# Altium project nRF2789_Dual Wireless Mic RX .PrjPCB
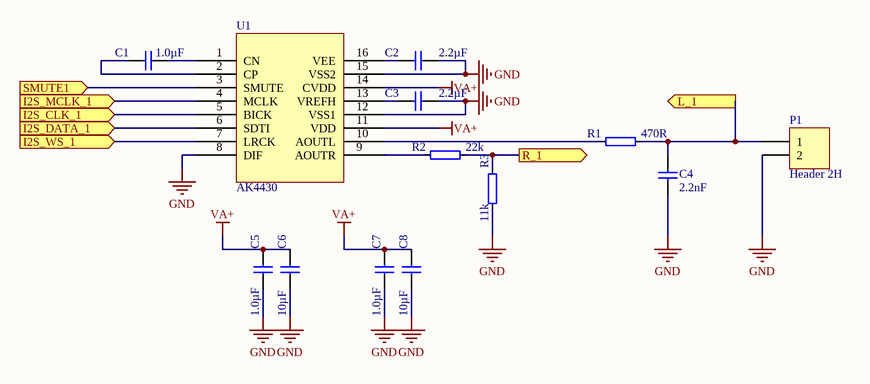
[diagram p0: AK4430_1.SchDoc]
7 sheets, 110 parts. Net scope: flat (ports and power ports of the same name join across sheets).
Board file: nRF2789_Dual Wireless Mic RX_V_1_0.PcbDoc
Sheets:
  AK4430_1.SchDoc
  Micro.SchDoc
  Power.SchDoc
  AK5374.SchDoc
  AK4430_2.SchDoc
  Nrf2460_1.SchDoc
  Nrf2460_2.SchDoc

## Sheet AK4430_1.SchDoc: nRF2789_Dual_Wireless_Mic_RX
size A4; DrawnBy: ANOL; Revision: 1.0

### Parts
C1  1.0µF  [0603s]
C2  2.2µF  [0603s]
C3  2.2µF  [0603s]
C4  2.2nF  [0402s]
C5  1.0µF  [0603s]
C6  10µF  [0805]
C7  1.0µF  [0603s]
C8  10µF  [0805]
P1  Header 2H  [RCA]
R1  470R  [0402s]
R2  22k  [0402s]
R3  11k  [0402s]
U1  AK4430  [TSOP65P640X110-16N]

### Ports
I2S_CLK_1 (in), I2S_DATA_1 (in), I2S_MCLK_1 (in), I2S_WS_1 (in), L_1 (out), R_1 (out), SMUTE1 (in)

### Nets
GND: C2.2 C3.2 C4.1 C5.1 C6.1 C7.1 C8.1 P1.2 R3.1 U1.8(DIF) U1.12(VSS1) U1.15(VSS2)
VA+: C5.2 C6.2 C7.2 C8.2 U1.11(VDD) U1.14(CVDD)
NetC1_1: C1.1 U1.2(CP)
NetC1_2: C1.2 U1.1(CN)
NetC2_1: C2.1 U1.16(VEE)
NetC3_1: C3.1 U1.13(VREFH)
NetC4_2: C4.2 P1.1 R1.2 ; port L_1
NetR1_1: R1.1 U1.10(AOUTL)
NetR2_1: R2.1 U1.9(AOUTR)
NetR2_2: R2.2 R3.2 ; port R_1
NetU1_3: U1.3(SMUTE) ; port SMUTE1
NetU1_4: U1.4(MCLK) ; port I2S_MCLK_1
NetU1_5: U1.5(BICK) ; port I2S_CLK_1
NetU1_6: U1.6(SDTI) ; port I2S_DATA_1
NetU1_7: U1.7(LRCK) ; port I2S_WS_1

### Library data of the parts
C1 C5 C7 = C0603-1µ0: Chip Cap 0603; Note: Chip Cap 10%; Artikkelnr Noca: 20039205; Part Number: C0603-1µ0; Manufacturer: *; Manufacturer Part Number: *; Datasheet: *; LatestRevisionDate: 2009-11-23; Pin Count: 2; Publisher: Nordic Semiconductor; Published: 2009-05-08; Value: 1.0µF; Supplier: *; Supplier part number: *; 2nd source Supplier: *; 2nd source part number: *
C2 C3 = C0603-2µ2: Chip Cap 0603; Note: Chip Cap 1%; Artikkelnr Noca: N.A.; Part Number: C0603-2µ2; Manufacturer: *; Manufacturer Part Number: *; Datasheet: *; LatestRevisionDate: 2009-05-08; Pin Count: 2; Publisher: Nordic Semiconductor; Published: 2009-05-08; Value: 2.2µF; Supplier: *; Supplier part number: *; 2nd source Supplier: *; 2nd source part number: *
C4 = C0402-2n2: Chip Cap 0402; Note: Chip Cap 10%; Artikkelnr Noca: 20039221; Part Number: C0402-2n2; Manufacturer: *; Manufacturer Part Number: *; Datasheet: *; LatestRevisionDate: 2009-11-23; Pin Count: 2; Publisher: Nordic Semiconductor; Published: 2009-05-08; Value: 2.2nF; Supplier: *; Supplier part number: *; 2nd source Supplier: *; 2nd source part number: *
C6 C8 = C0805-10µ: Chip Cap 0805; Note: Chip Cap 10%; Artikkelnr Noca: 20039243; Part Number: C0805-10µ; Manufacturer: *; Manufacturer Part Number: *; Datasheet: *; LatestRevisionDate: 2010-06-03; Pin Count: 2; Publisher: Nordic Semiconductor; Published: 2010-06-03; Value: 10µF; Supplier: *; Supplier part number: *; 2nd source Supplier: *; 2nd source part number: *
P1 = Header 2H: Header, 2-Pin, Right Angle; LatestRevisionDate: 17-Jul-2002; LatestRevisionNote: Re-released for DXP Platform.; Publisher: Altium Limited
R1 = R0402-470: Chip Res 0402; Note: Chip Res 1%; Artikkelnr Noca: 27049065; Part Number: R0402-470; Manufacturer: *; Manufacturer Part Number: *; Datasheet: *; Footprint: 0402; LatestRevisionDate: 2009-11-23; Pin Count: 2; Publisher: Nordic Semiconductor; Published: 2009-05-08; Value: 470R; Supplier: *; Supplier part number: *; 2nd source Supplier: *; 2nd source part number: *
R2 = R0402-22k: Chip Res 0402; Note: Chip Res 1%; Artikkelnr Noca: 27049105; Part Number: R0402-22k; Manufacturer: *; Manufacturer Part Number: *; Datasheet: *; Footprint: 0402; LatestRevisionDate: 2009-11-23; Pin Count: 2; Publisher: Nordic Semiconductor; Published: 2009-05-08; Value: 22k; Supplier: *; Supplier part number: *; 2nd source Supplier: *; 2nd source part number: *
R3 = R0402-10k: Chip Res 0402; Note: Chip Res 1%; Part Number: R0402-10k; Manufacturer: *; Manufacturer Part Number: *; Datasheet: *; Footprint: 0402; LatestRevisionDate: 2009-11-23; Pin Count: 2; Publisher: Nordic Semiconductor; Published: 2009-05-08; Value: 11k; Supplier: *; Supplier part number: *; 2nd source Supplier: *; 2nd source part number: *

## Sheet Micro.SchDoc: nRF2789_Dual_Wireless_Mic_RX
size A4; DrawnBy: ANOL; Revision: 1.0
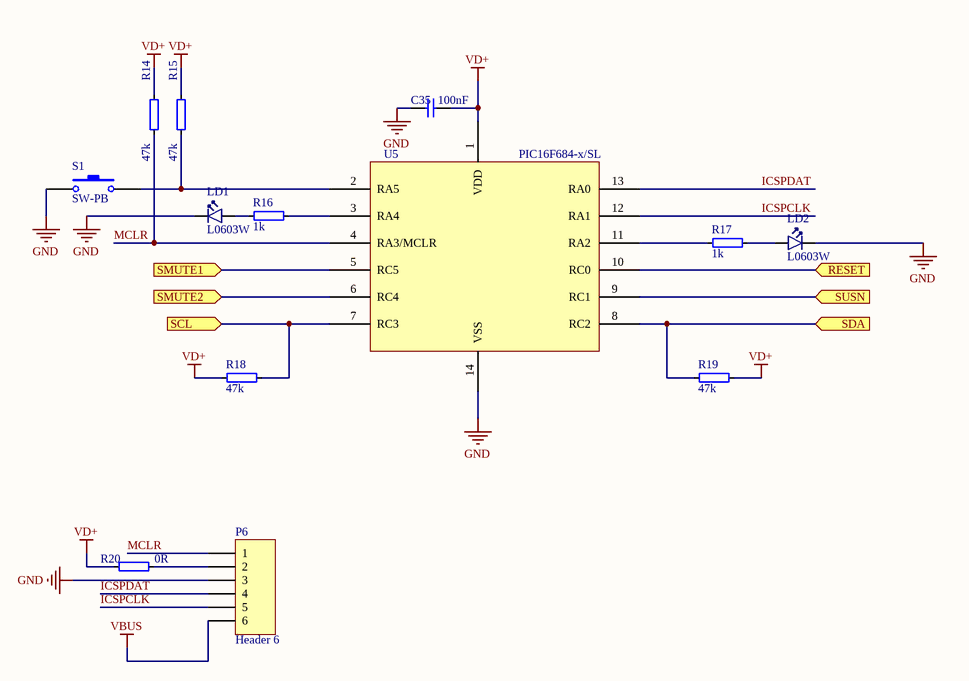
[diagram p1: Micro.SchDoc]

### Parts
C35  100nF  [0402s]
LD1  L0603W  [LED_0603]
LD2  L0603W  [LED_0603]
P6  Header 6  [HDR1X6]
R14  47k  [0402s]
R15  47k  [0402s]
R16  1k  [0402s]
R17  1k  [0402s]
R18  47k  [0402s]
R19  47k  [0402s]
R20  0R  [0402s]
S1  SW-PB  [E-Switch]
U5  PIC16F684-x/SL  [TSOP65P640X120-14N]

### Ports
RESET (in), SCL (in), SDA (in), SMUTE1 (in), SMUTE2 (in), SUSN (in)

### Nets
GND: C35.1 LD1.1(C) LD2.1(C) P6.3 S1.1 U5.14(VSS)
VBUS: P6.6
VD+: C35.2 R14.2 R15.2 R18.1 R19.1 R20.1 U5.1(VDD)
ICSPCLK: P6.5 U5.12(RA1)
ICSPDAT: P6.4 U5.13(RA0)
MCLR: P6.1 R14.1 U5.4(RA3/MCLR)
NetLD1_2: LD1.2(A) R16.2
NetLD2_2: LD2.2(A) R17.2
NetP6_2: P6.2 R20.2
NetR15_1: R15.1 S1.2 U5.2(RA5)
NetR16_1: R16.1 U5.3(RA4)
NetR17_1: R17.1 U5.11(RA2)
NetR18_2: R18.2 U5.7(RC3) ; port SCL
NetR19_2: R19.2 U5.8(RC2) ; port SDA
NetR21_1: U5.10(RC0) ; port RESET
NetU1_3: U5.5(RC5) ; port SMUTE1
NetU2_3: U5.6(RC4) ; port SMUTE2
NetU4_7: U5.9(RC1) ; port SUSN

### Library data of the parts
C35 = C0402-100n: Chip Cap 0402; Note: Chip Cap 10%; Artikkelnr Noca: 20039200; Part Number: C0402-100n; Manufacturer: *; Manufacturer Part Number: *; Datasheet: *; LatestRevisionDate: 2009-11-23; Pin Count: 2; Publisher: Nordic Semiconductor; Published: 2009-05-08; Value: 100nF; Supplier: *; Supplier part number: *; 2nd source Supplier: *; 2nd source part number: *
LD1 LD2 = 19-213/W1D: LED 0603, 19-213/W1D; Manufacturer: Everlight; Note: 45 mcd; Artikkelnr Noca: N.A.; Part Number: 19-213/W1D; Manufacturer Part Number: *; Datasheet: *; Footprint: 0603; LatestRevisionDate: 2009-05-18; Pin Count: 2; Publisher: Nordic Semiconductor; Published: 2009-05-18; Value: L0603W; Supplier: *; Supplier part number: *; 2nd source Supplier: *; 2nd source part number: *
P6 = Header 6: Header, 6-Pin; LatestRevisionDate: 17-Jul-2002; LatestRevisionNote: Re-released for DXP Platform.; Publisher: Altium Limited
R14 R15 R18 R19 = R0402-47k: Chip Res 0402; Note: Chip Res 1%; Artikkelnr Noca: 27049113; Part Number: R0402-47k; Manufacturer: *; Manufacturer Part Number: *; Datasheet: *; Footprint: 0402; LatestRevisionDate: 2009-11-23; Pin Count: 2; Publisher: Nordic Semiconductor; Published: 2009-05-08; Value: 47k; Supplier: *; Supplier part number: *; 2nd source Supplier: *; 2nd source part number: *
R16 R17 = R0402-1k0: Chip Res 0402; Note: Chip Res 1%; Artikkelnr Noca: 27049073; Part Number: R0402-1k0; Manufacturer: *; Manufacturer Part Number: *; Datasheet: *; Footprint: 0402; LatestRevisionDate: 2009-11-23; Pin Count: 2; Publisher: Nordic Semiconductor; Published: 2009-05-08; Value: 1k; Supplier: *; Supplier part number: *; 2nd source Supplier: *; 2nd source part number: *
R20 = R0402-0R: Chip Res 0402; Note: Chip Res 1%; Artikkelnr Noca: 27049000; Part Number: R0402-0R; Manufacturer: *; Manufacturer Part Number: *; Datasheet: *; Footprint: 0402; LatestRevisionDate: 2009-11-23; Pin Count: 2; Publisher: Nordic Semiconductor; Published: 2009-05-08; Value: 0R; Supplier: *; Supplier part number: *; 2nd source Supplier: *; 2nd source part number: *
S1 = SW-PB: Switch; Published: 24-Mar-1999; LatestRevisionDate: 17-Jul-2002; LatestRevisionNote: Re-released for DXP Platform.; PackageReference: SPST-2; Publisher: Altium Limited; PackageDescription: Switch; 2 Leads

## Sheet Power.SchDoc: nRF2789_Dual_Wireless_Mic_RX
size A4; DrawnBy: ANOL; Revision: 1.0
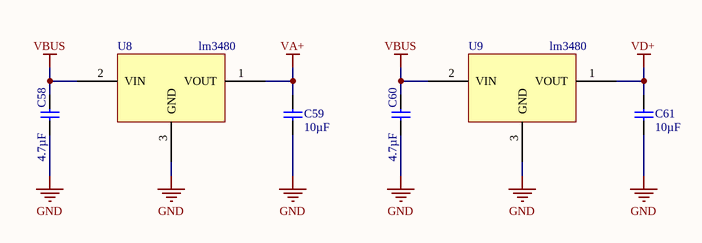
[diagram p2: Power.SchDoc]

### Parts
C58  4.7µF  [0805]
C59  10µF  [0805]
C60  4.7µF  [0805]
C61  10µF  [0805]
U8  lm3480  [SOT95P237X112-3N]
U9  lm3480  [SOT95P237X112-3N]

### Nets
GND: C58.1 C59.1 C60.1 C61.1 U8.3(GND) U9.3(GND)
VA+: C59.2 U8.1(VOUT)
VBUS: C58.2 C60.2 U8.2(VIN) U9.2(VIN)
VD+: C61.2 U9.1(VOUT)

### Library data of the parts
C58 C60 = C0805-4µ7: Chip Cap 0805; Note: Chip Cap 10%; Artikkelnr Noca: 20039266; Part Number: C0805-4µ7; Manufacturer: *; Manufacturer Part Number: *; Datasheet: *; LatestRevisionDate: 2009-11-23; Pin Count: 2; Publisher: Nordic Semiconductor; Published: 2009-08-21; Value: 4.7µF; Supplier: *; Supplier part number: *; 2nd source Supplier: *; 2nd source part number: *
C59 C61 = C0805-10µ: as C6 on sheet AK4430_1; Part Number: C0805-10µ; Manufacturer: *; Manufacturer Part Number: *; Datasheet: *; LatestRevisionDate: 2010-06-03; Pin Count: 2; Publisher: Nordic Semiconductor; Published: 2010-06-03; Value: 10µF; Supplier: *; Supplier part number: *; 2nd source Supplier: *; 2nd source part number: *

## Sheet AK5374.SchDoc: nRF2789_Dual_Wireless_Mic_RX
size A4; DrawnBy: ANOL; Revision: 1.0
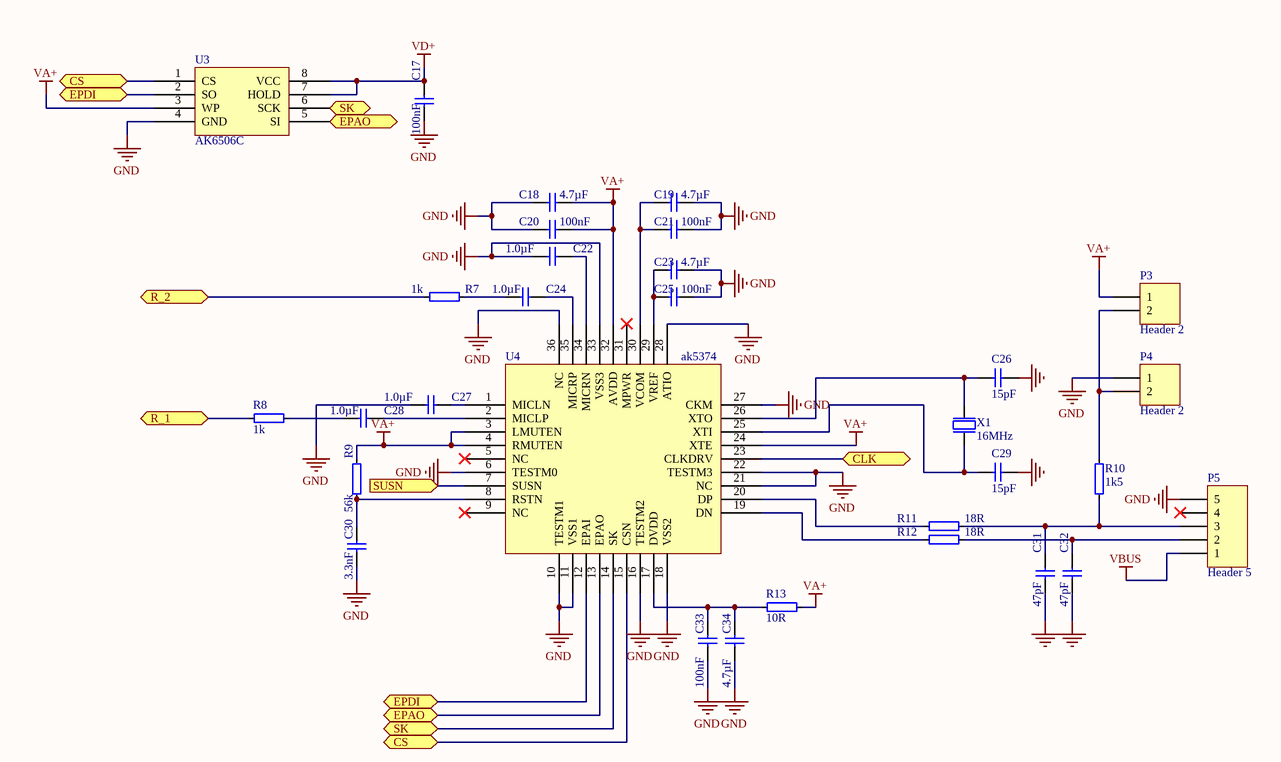
[diagram p3: AK5374.SchDoc]

### Parts
C17  100nF  [0402s]
C18  4.7µF  [0603s]
C19  4.7µF  [0603s]
C20  100nF  [0402s]
C21  100nF  [0402s]
C22  1.0µF  [0402s]
C23  4.7µF  [0603s]
C24  1.0µF  [0402s]
C25  100nF  [0402s]
C26  15pF  [0402s]
C27  1.0µF  [0402s]
C28  1.0µF  [0402s]
C29  15pF  [0402s]
C30  3.3nF  [0402s]
C31  47pF  [0402s]
C32  47pF  [0402s]
C33  100nF  [0402s]
C34  4.7µF  [0603s]
P3  Header 2  [HDR1X2]
P4  Header 2  [HDR1X2]
P5  Header 5  [Mini USB-B]
R7  1k  [0402s]
R8  1k  [0402s]
R9  56k  [0402s]
R10  1k5  [0402s]
R11  18R  [0402s]
R12  18R  [0402s]
R13  10R  [0402s]
U3  AK6506C  [TSOP65P400X95-8N]
U4  ak5374  [QFN40P500X500X80-36N]
X1  16MHz  [BT-XTAL_3225]

### Ports
CLK, CS, EPAO, EPDI, R_1, R_2, SK, SUSN (in)

### Nets
GND: C17.1 C18.2 C19.1 C20.2 C21.1 C22.1 C23.1 C25.1 C26.1 C27.1 C29.1 C30.1 C31.2 C32.2 C33.1 C34.1 P4.1 P5.5 U3.4(GND) U4.6(TESTM0) U4.10(TESTM1) U4.11(VSS1) U4.16(TESTM2) U4.18(VSS2) U4.21(NC) U4.22(TESTM3) U4.27(CKM) U4.28(ATIO) U4.33(VSS3) U4.36(NC) X1.2(GND) X1.4(GND)
VA+: C18.1 C20.1 P3.1 R9.2 R13.2 U3.3(WP) U4.3(LMUTEN) U4.4(RMUTEN) U4.24(XTE) U4.32(AVDD)
VBUS: P5.1
VD+: C17.2 U3.7(HOLD) U3.8(VCC)
NetC19_2: C19.2 C21.2 U4.30(VCOM)
NetC22_2: C22.2 U4.34(MICRN)
NetC23_2: C23.2 C25.2 U4.29(VREF)
NetC24_1: C24.1 R7.1
NetC24_2: C24.2 U4.35(MICRP)
NetC26_2: C26.2 U4.26(XTO) X1.1(inp)
NetC27_2: C27.2 U4.1(MICLN)
NetC28_1: C28.1 R8.1
NetC28_2: C28.2 U4.2(MICLP)
NetC29_2: C29.2 U4.25(XTI) X1.3(out)
NetC30_2: C30.2 R9.1 U4.8(RSTN)
NetC31_1: C31.1 P5.3 R10.1 R11.2
NetC32_1: C32.1 P5.2 R12.2
NetC33_2: C33.2 C34.2 R13.1 U4.17(DVDD)
NetP3_2: P3.2 P4.2 R10.2
NetR2_2: R8.2 ; port R_1
NetR5_2: R7.2 ; port R_2
NetR11_1: R11.1 U4.20(DP)
NetR12_1: R12.1 U4.19(DN)
NetU3_1: U3.1(CS) U4.15(CSN) ; port CS
NetU3_2: U3.2(SO) U4.12(EPAI) ; port EPDI
NetU3_5: U3.5(SI) U4.13(EPAO) ; port EPAO
NetU3_6: U3.6(SCK) U4.14(SK) ; port SK
NetU4_7: U4.7(SUSN) ; port SUSN
NetU4_23: U4.23(CLKDRV) ; port CLK

Not connected (* = marked no-connect by the designer): P5 4*; U4 5(NC)* 9(NC)* 31(MPWR)*

### Library data of the parts
C17 C20 C21 C25 C33 = C0402-100n: as C35 on sheet Micro; Part Number: C0402-100n; Manufacturer: *; Manufacturer Part Number: *; Datasheet: *; LatestRevisionDate: 2009-11-23; Pin Count: 2; Publisher: Nordic Semiconductor; Published: 2009-05-08; Value: 100nF; Supplier: *; Supplier part number: *; 2nd source Supplier: *; 2nd source part number: *
C18 C19 C23 C34 = C0603-4µ7: Chip Cap 0603; Note: Chip Cap 10%; Artikkelnr Noca: 20069060; Part Number: C0603-4µ7; Manufacturer: *; Manufacturer Part Number: *; Datasheet: *; LatestRevisionDate: 2009-11-23; Pin Count: 2; Publisher: Nordic Semiconductor; Published: 2009-05-08; Value: 4.7µF; Supplier: *; Supplier part number: *; 2nd source Supplier: *; 2nd source part number: *
C22 C24 C27 C28 = C0402-1µ0: Chip Cap 0402; Note: Chip Cap 1%; Artikkelnr Noca: 20039235; Part Number: C0402-1µ0; Manufacturer: *; Manufacturer Part Number: *; Datasheet: *; LatestRevisionDate: 2009-11-23; Pin Count: 2; Publisher: Nordic Semiconductor; Published: 2009-05-08; Value: 1.0µF; Supplier: *; Supplier part number: *; 2nd source Supplier: *; 2nd source part number: *
C26 C29 = C0402-15p: Chip Cap 0402; Note: Chip Cap 5%; Artikkelnr Noca: 20029141; Published: 2009-05-08; Publisher: Nordic Semiconductor; Value: 15pF; Part Number: C0402-15p; Manufacturer: *; Manufacturer Part Number: *; Datasheet: *; LatestRevisionDate: 2009-11-23; Pin Count: 2; Supplier: *; Supplier part number: *; 2nd source Supplier: *; 2nd source part number: *
C30 = C0402-3n3: Chip Cap 0402; Note: Chip Cap 1%; Artikkelnr Noca: N.A.; Part Number: C0402-3n3; Manufacturer: *; Manufacturer Part Number: *; Datasheet: *; LatestRevisionDate: 2009-05-08; Pin Count: 2; Publisher: Nordic Semiconductor; Published: 2009-05-08; Value: 3.3nF; Supplier: *; Supplier part number: *; 2nd source Supplier: *; 2nd source part number: *
C31 C32 = C0402-47p: Chip Cap 0402; Note: Chip Cap 1%; Artikkelnr Noca: N.A.; Part Number: C0402-47p; Manufacturer: *; Manufacturer Part Number: *; Datasheet: *; LatestRevisionDate: 2009-05-08; Pin Count: 2; Publisher: Nordic Semiconductor; Published: 2009-05-08; Value: 47pF; Supplier: *; Supplier part number: *; 2nd source Supplier: *; 2nd source part number: *
P3 P4 = Header 2: Header, 2-Pin; LatestRevisionDate: 17-Jul-2002; LatestRevisionNote: Re-released for DXP Platform.; Publisher: Altium Limited
P5 = Header 5: Header, 5-Pin; LatestRevisionDate: 17-Jul-2002; LatestRevisionNote: Re-released for DXP Platform.; Publisher: Altium Limited
R7 R8 = R0402-1k0: as R16 on sheet Micro; Part Number: R0402-1k0; Manufacturer: *; Manufacturer Part Number: *; Datasheet: *; Footprint: 0402; LatestRevisionDate: 2009-11-23; Pin Count: 2; Publisher: Nordic Semiconductor; Published: 2009-05-08; Value: 1k; Supplier: *; Supplier part number: *; 2nd source Supplier: *; 2nd source part number: *
R9 = R0402-56k: Chip Res 0402; Note: Chip Res 1%; Artikkelnr Noca: 27049115; Part Number: R0402-56k; Manufacturer: *; Manufacturer Part Number: *; Datasheet: *; Footprint: 0402; LatestRevisionDate: 2009-11-23; Pin Count: 2; Publisher: Nordic Semiconductor; Published: 2009-05-08; Value: 56k; Supplier: *; Supplier part number: *; 2nd source Supplier: *; 2nd source part number: *
R10 = R0402-1k5: Chip Res 0402; Note: Chip Res 1%; Artikkelnr Noca: 27049077; Part Number: R0402-1k5; Manufacturer: *; Manufacturer Part Number: *; Datasheet: *; Footprint: 0402; LatestRevisionDate: 2009-11-23; Pin Count: 2; Publisher: Nordic Semiconductor; Published: 2009-05-08; Value: 1k5; Supplier: *; Supplier part number: *; 2nd source Supplier: *; 2nd source part number: *
R11 R12 = R0402-18R: Chip Res 0402; Note: Chip Res 1%; Artikkelnr Noca: 27049031; Part Number: R0402-18R; Manufacturer: *; Manufacturer Part Number: *; Datasheet: *; Footprint: 0402; LatestRevisionDate: 2009-11-23; Pin Count: 2; Publisher: Nordic Semiconductor; Published: 2009-05-08; Value: 18R; Supplier: *; Supplier part number: *; 2nd source Supplier: *; 2nd source part number: *
R13 = R0402-10R: Chip Res 0402; Note: Chip Res 1%; Artikkelnr Noca: 27049025; Part Number: R0402-10R; Manufacturer: *; Manufacturer Part Number: *; Datasheet: *; Footprint: 0402; LatestRevisionDate: 2009-11-23; Pin Count: 2; Publisher: Nordic Semiconductor; Published: 2009-05-08; Value: 10R; Supplier: *; Supplier part number: *; 2nd source Supplier: *; 2nd source part number: *
X1 = XTAL SMD 16MHz (3225): XTAL SMD 16MHz, 9pF, Mercury; Note: XTAL SMD 16MHz 3225; Artikkelnr Noca: 22019087; Part Number: XTAL SMD 16MHz (3225); Manufacturer: *; Manufacturer Part Number: *; Datasheet: http://ndap3-net.ebz.epson.co.jp/w/www/PDFS/epdoc_qd.nsf/85a4e2c523a1f89349257068002f9e30/31e98956c8f991cd4925707c003b38b1/$FILE/FA-238_238V_TSX-3225_E08X.pdf; LatestRevisionDate: 2010-02-24; Pin Count: 4; Publisher: Nordic Semiconductor; Published: 2009-05-30; Value: 16MHz; Supplier: *; Supplier part number: *; 2nd source Supplier: *; 2nd source part number: *

## Sheet AK4430_2.SchDoc: nRF2789_Dual_Wireless_Mic_RX
size A4; DrawnBy: ANOL; Revision: 1.0
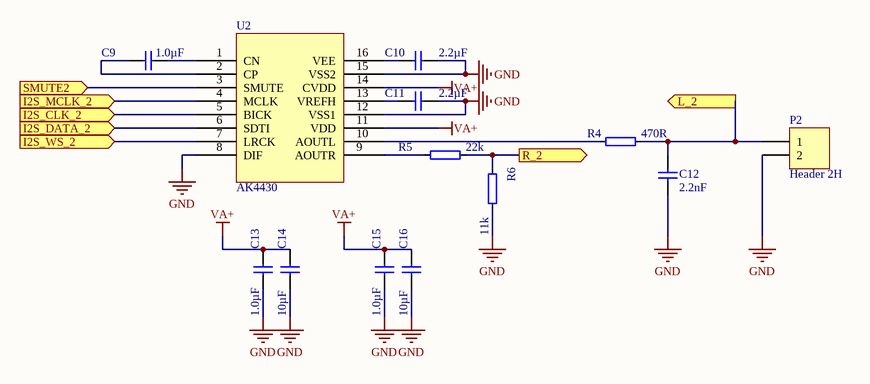
[diagram p4: AK4430_2.SchDoc]

### Parts
C9  1.0µF  [0603s]
C10  2.2µF  [0603s]
C11  2.2µF  [0603s]
C12  2.2nF  [0402s]
C13  1.0µF  [0603s]
C14  10µF  [0805]
C15  1.0µF  [0603s]
C16  10µF  [0805]
P2  Header 2H  [RCA]
R4  470R  [0402s]
R5  22k  [0402s]
R6  11k  [0402s]
U2  AK4430  [TSOP65P640X110-16N]

### Ports
I2S_CLK_2 (in), I2S_DATA_2 (in), I2S_MCLK_2 (in), I2S_WS_2 (in), L_2 (out), R_2 (out), SMUTE2 (in)

### Nets
GND: C10.2 C11.2 C12.1 C13.1 C14.1 C15.1 C16.1 P2.2 R6.1 U2.8(DIF) U2.12(VSS1) U2.15(VSS2)
VA+: C13.2 C14.2 C15.2 C16.2 U2.11(VDD) U2.14(CVDD)
NetC9_1: C9.1 U2.2(CP)
NetC9_2: C9.2 U2.1(CN)
NetC10_1: C10.1 U2.16(VEE)
NetC11_1: C11.1 U2.13(VREFH)
NetC12_2: C12.2 P2.1 R4.2 ; port L_2
NetR4_1: R4.1 U2.10(AOUTL)
NetR5_1: R5.1 U2.9(AOUTR)
NetR5_2: R5.2 R6.2 ; port R_2
NetU2_3: U2.3(SMUTE) ; port SMUTE2
NetU2_4: U2.4(MCLK) ; port I2S_MCLK_2
NetU2_5: U2.5(BICK) ; port I2S_CLK_2
NetU2_6: U2.6(SDTI) ; port I2S_DATA_2
NetU2_7: U2.7(LRCK) ; port I2S_WS_2

### Library data of the parts
C9 C13 C15 = C0603-1µ0: as C1 on sheet AK4430_1; Part Number: C0603-1µ0; Manufacturer: *; Manufacturer Part Number: *; Datasheet: *; LatestRevisionDate: 2009-11-23; Pin Count: 2; Publisher: Nordic Semiconductor; Published: 2009-05-08; Value: 1.0µF; Supplier: *; Supplier part number: *; 2nd source Supplier: *; 2nd source part number: *
C10 C11 = C0603-2µ2: as C2 on sheet AK4430_1; Part Number: C0603-2µ2; Manufacturer: *; Manufacturer Part Number: *; Datasheet: *; LatestRevisionDate: 2009-05-08; Pin Count: 2; Publisher: Nordic Semiconductor; Published: 2009-05-08; Value: 2.2µF; Supplier: *; Supplier part number: *; 2nd source Supplier: *; 2nd source part number: *
C12 = C0402-2n2: as C4 on sheet AK4430_1; Part Number: C0402-2n2; Manufacturer: *; Manufacturer Part Number: *; Datasheet: *; LatestRevisionDate: 2009-11-23; Pin Count: 2; Publisher: Nordic Semiconductor; Published: 2009-05-08; Value: 2.2nF; Supplier: *; Supplier part number: *; 2nd source Supplier: *; 2nd source part number: *
C14 C16 = C0805-10µ: as C6 on sheet AK4430_1; Part Number: C0805-10µ; Manufacturer: *; Manufacturer Part Number: *; Datasheet: *; LatestRevisionDate: 2010-06-03; Pin Count: 2; Publisher: Nordic Semiconductor; Published: 2010-06-03; Value: 10µF; Supplier: *; Supplier part number: *; 2nd source Supplier: *; 2nd source part number: *
P2 = Header 2H: Header, 2-Pin, Right Angle; LatestRevisionDate: 17-Jul-2002; LatestRevisionNote: Re-released for DXP Platform.; Publisher: Altium Limited
R4 = R0402-470: as R1 on sheet AK4430_1; Part Number: R0402-470; Manufacturer: *; Manufacturer Part Number: *; Datasheet: *; Footprint: 0402; LatestRevisionDate: 2009-11-23; Pin Count: 2; Publisher: Nordic Semiconductor; Published: 2009-05-08; Value: 470R; Supplier: *; Supplier part number: *; 2nd source Supplier: *; 2nd source part number: *
R5 = R0402-22k: as R2 on sheet AK4430_1; Part Number: R0402-22k; Manufacturer: *; Manufacturer Part Number: *; Datasheet: *; Footprint: 0402; LatestRevisionDate: 2009-11-23; Pin Count: 2; Publisher: Nordic Semiconductor; Published: 2009-05-08; Value: 22k; Supplier: *; Supplier part number: *; 2nd source Supplier: *; 2nd source part number: *
R6 = R0402-10k: Chip Res 0402; Note: Chip Res 1%; Part Number: R0402-10k; Manufacturer: *; Manufacturer Part Number: *; Datasheet: *; Footprint: 0402; LatestRevisionDate: 2009-11-23; Pin Count: 2; Publisher: Nordic Semiconductor; Published: 2009-05-08; Value: 11k; Supplier: *; Supplier part number: *; 2nd source Supplier: *; 2nd source part number: *

## Sheet Nrf2460_1.SchDoc: nRF2789_Dual_Wireless_Mic_RX
size A4; DrawnBy: ANOL; Revision: 1.0
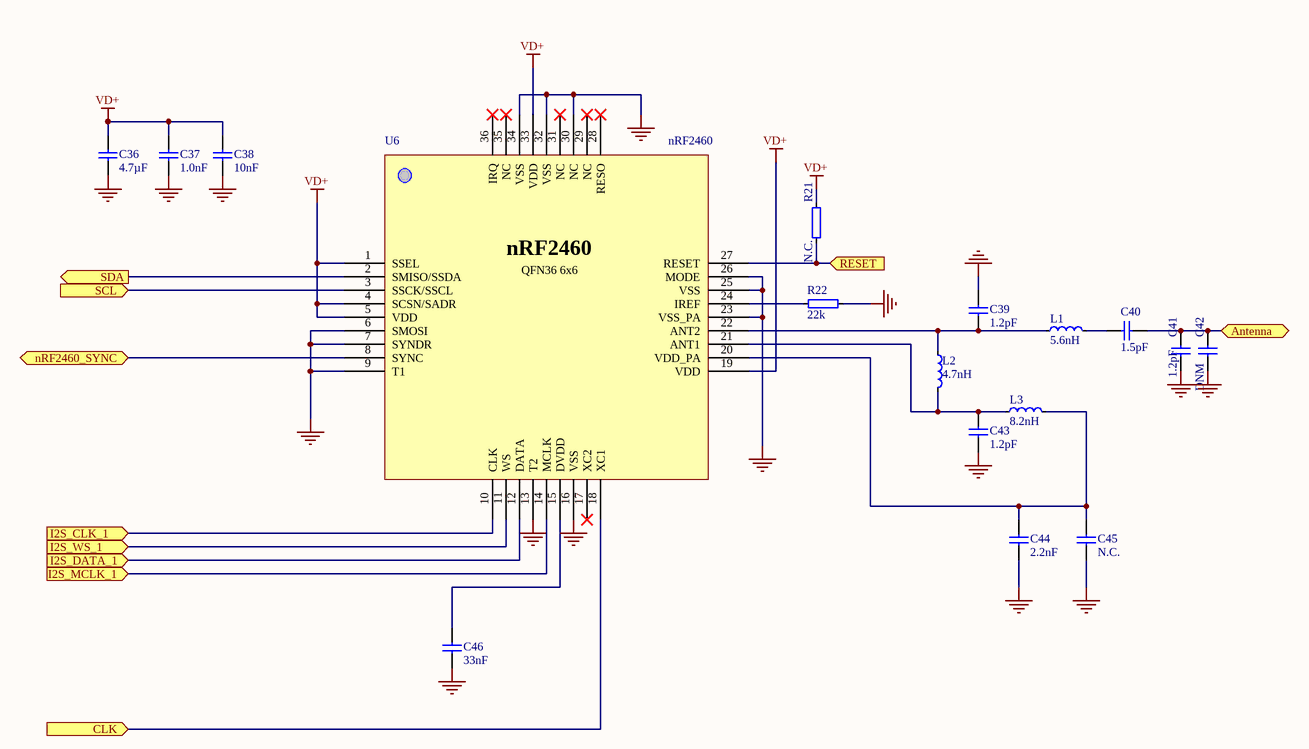
[diagram p5: Nrf2460_1.SchDoc]

### Parts
C36  4.7µF  [0805]
C37  1.0nF  [0402s]
C38  10nF  [0402s]
C39  1.2pF  [0402s]
C40  1.5pF  [0402s]
C41  1.2pF  [0402s]
C42  DNM  [0402s]
C43  1.2pF  [0402s]
C44  2.2nF  [0402s]
C45  N.C.  [0402s]  (no BOM)
C46  33nF  [0402s]
L1  5.6nH  [0402s]
L2  4.7nH  [0402s]
L3  8.2nH  [0402s]
R21  N.C.  [0402s]  (no BOM)
R22  22k  [0402s]
U6  nRF2460  [Nordic_QFN36]

### Ports
Antenna (bidir), CLK (in), I2S_CLK_1 (in), I2S_DATA_1 (in), I2S_MCLK_1 (in), I2S_WS_1 (in), nRF2460_SYNC (bidir), RESET (in), SCL (in), SDA (out)

### Nets
GND: C36.2 C37.2 C38.2 C39.2 C41.1 C42.1 C43.1 C44.1 C45.1 C46.1 R22.1 U6.6(SMOSI) U6.7(SYNDR) U6.9(T1) U6.13(T2) U6.16(VSS) U6.23(VSS_PA) U6.25(VSS) U6.26(MODE) U6.30(NC) U6.32(VSS) U6.34(VSS)
VD+: C36.1 C37.1 C38.1 R21.2 U6.1(SSEL) U6.4(SCSN/SADR) U6.5(VDD) U6.19(VDD) U6.33(VDD)
NetC39_1: C39.1 L1.1 L2.1 U6.22(ANT2)
NetC40_1: C40.1 C41.2 C42.2 ; port Antenna
NetC40_2: C40.2 L1.2
NetC43_2: C43.2 L2.2 L3.1 U6.21(ANT1)
NetC44_2: C44.2 C45.2 L3.2 U6.20(VDD_PA)
NetC46_2: C46.2 U6.15(DVDD)
NetR18_2: U6.3(SSCK/SSCL) ; port SCL
NetR19_2: U6.2(SMISO/SSDA) ; port SDA
NetR21_1: R21.1 U6.27(RESET) ; port RESET
NetR22_2: R22.2 U6.24(IREF)
NetU1_4: U6.14(MCLK) ; port I2S_MCLK_1
NetU1_5: U6.10(CLK) ; port I2S_CLK_1
NetU1_6: U6.12(DATA) ; port I2S_DATA_1
NetU1_7: U6.11(WS) ; port I2S_WS_1
NetU4_23: U6.18(XC1) ; port CLK
NetU6_8: U6.8(SYNC) ; port nRF2460_SYNC

Not connected (* = marked no-connect by the designer): U6 17(XC2)* 28(RESO)* 29(NC)* 31(NC)* 35(NC)* 36(IRQ)*

### Notes on the sheet
- (in symbol nRF2460) QFN36 6x6

### Library data of the parts
C36 = C0805-4µ7: as C58 on sheet Power; Published: 2009-08-21; LatestRevisionDate: 2009-11-23; Publisher: Nordic Semiconductor; Value: 4.7µF; Part Number: C0805-4µ7; Manufacturer: *; Manufacturer Part Number: *; Datasheet: *; Pin Count: 2; Supplier: *; Supplier part number: *; 2nd source Supplier: *; 2nd source part number: *
C37 = C0402-1n0: Chip Cap 0402; Note: Chip Cap 10%; Artikkelnr Noca: 20039223; Published: 2009-05-08; LatestRevisionDate: 2009-11-23; Publisher: Nordic Semiconductor; Value: 1.0nF; Part Number: C0402-1n0; Manufacturer: *; Manufacturer Part Number: *; Datasheet: *; Pin Count: 2; Supplier: *; Supplier part number: *; 2nd source Supplier: *; 2nd source part number: *
C38 = C0402-10n: Chip Cap 0402; Note: Chip Cap 10%; Artikkelnr Noca: 20039166; Published: 2009-05-08; LatestRevisionDate: 2009-11-23; Publisher: Nordic Semiconductor; Value: 10nF; Part Number: C0402-10n; Manufacturer: *; Manufacturer Part Number: *; Datasheet: *; Pin Count: 2; Supplier: *; Supplier part number: *; 2nd source Supplier: *; 2nd source part number: *
C39 C41-C43 = C0402-1.2p: Chip Cap 0402; Note: Chip Cap 1%; Artikkelnr Noca: N.A.; Part Number: C0402-1.2p; Manufacturer: *; Manufacturer Part Number: *; Datasheet: *; LatestRevisionDate: 2009-05-08; Pin Count: 2; Publisher: Nordic Semiconductor; Published: 2009-05-08; Supplier: *; Supplier part number: *; 2nd source Supplier: *; 2nd source part number: *
  C39 C41 C43: Value: 1.2pF
  C42: Value: DNM
C40 = C0402-1.5p: Chip Cap 0402; Note: Chip Cap 1%; Artikkelnr Noca: 20029139; Part Number: C0402-1.5p; Manufacturer: *; Manufacturer Part Number: *; Datasheet: *; LatestRevisionDate: 2009-11-23; Pin Count: 2; Publisher: Nordic Semiconductor; Published: 2009-05-08; Value: 1.5pF; Supplier: *; Supplier part number: *; 2nd source Supplier: *; 2nd source part number: *
C44 = C0402-2n2: as C4 on sheet AK4430_1; Part Number: C0402-2n2; Manufacturer: *; Manufacturer Part Number: *; Datasheet: *; LatestRevisionDate: 2009-11-23; Pin Count: 2; Publisher: Nordic Semiconductor; Published: 2009-05-08; Value: 2.2nF; Supplier: *; Supplier part number: *; 2nd source Supplier: *; 2nd source part number: *
C45 = C0402-N.C.: Chip Cap 0402; Artikkelnr Noca: N.A.; Part Number: C0402-N.C.; Manufacturer: *; Manufacturer Part Number: *; Datasheet: *; LatestRevisionDate: 2009-05-08; Pin Count: 2; Publisher: Nordic Semiconductor; Published: 2009-05-08; Value: N.C.; Note: Chip Cap; Supplier: *; Supplier part number: *; 2nd source Supplier: *; 2nd source part number: *
C46 = C0402-33n: Chip Cap 0402; Note: Chip Cap 10%; Artikkelnr Noca: 20039222; Published: 2009-05-08; Publisher: Nordic Semiconductor; Value: 33nF; Part Number: C0402-33n; Manufacturer: *; Manufacturer Part Number: *; Datasheet: *; LatestRevisionDate: 2009-11-23; Pin Count: 2; Supplier: *; Supplier part number: *; 2nd source Supplier: *; 2nd source part number: *
L1 = L0402-5n6: Chip Ind 0402; Manufacturer: Murata; Manufacturer Part Number: LQP15MN5N6B02D; Note: LQP15MN5N6B02D 5.6nH 140mA 0402; Artikkelnr Noca: 33029161; Part Number: L0402-5n6; Datasheet: http://search.murata.co.jp/Ceramy/image/img/PDF/ENG/L0075S0084LQP15M.pdf; Footprint: 0402; LatestRevisionDate: 2009-11-23; Pin Count: 2; Publisher: Nordic Semiconductor; Published: 2009-05-08; Value: 5.6nH; Supplier: Digi-Key; Supplier part number: 490-1133-1-ND; 2nd source Supplier: *; 2nd source part number: *
L2 = L0402-4n7: Chip Ind 0402; Manufacturer: Murata; Manufacturer Part Number: LQP15MN4N7B02D; Note: LQP15MN4N7B02D 4.7nH 160mA 0402; Artikkelnr Noca: 33029164; Part Number: L0402-4n7; Datasheet: http://search.murata.co.jp/Ceramy/image/img/PDF/ENG/L0075S0084LQP15M.pdf; Footprint: 0402; LatestRevisionDate: 2009-11-23; Pin Count: 2; Publisher: Nordic Semiconductor; Published: 2009-05-08; Value: 4.7nH; Supplier: Digi-Key; Supplier part number: 490-1132-1-ND; 2nd source Supplier: *; 2nd source part number: *
L3 = L0402-8n2: Chip Ind 0402; Manufacturer: Murata; Manufacturer Part Number: LQP15MN8N2B02D; Note: LQP15MN8N2B02D 8.2nH 110mA 0402; Artikkelnr Noca: 33029139; Part Number: L0402-8n2; Datasheet: http://search.murata.co.jp/Ceramy/image/img/PDF/ENG/L0075S0084LQP15M.pdf; Footprint: 0402; LatestRevisionDate: 2009-11-23; Pin Count: 2; Publisher: Nordic Semiconductor; Published: 2009-05-08; Value: 8.2nH; Supplier: Digi-Key; Supplier part number: 490-1135-1-ND; 2nd source Supplier: *; 2nd source part number: *
R21 = R0402-N.C.: Chip Res 0402; Part Number: R0402-N.C.; Manufacturer: *; Manufacturer Part Number: *; Datasheet: *; Footprint: 0402; LatestRevisionDate: 2009-05-08; Pin Count: 2; Publisher: Nordic Semiconductor; Published: 2009-05-08; Value: N.C.; Note: Chip Res; Supplier: *; Supplier part number: *; 2nd source Supplier: *; 2nd source part number: *; Artikkelnr Noca: *
R22 = R0402-22k: as R2 on sheet AK4430_1; Published: 2009-05-08; Publisher: Nordic Semiconductor; Value: 22k; Part Number: R0402-22k; Manufacturer: *; Manufacturer Part Number: *; Datasheet: *; Footprint: 0402; LatestRevisionDate: 2009-11-23; Pin Count: 2; Supplier: *; Supplier part number: *; 2nd source Supplier: *; 2nd source part number: *
U6 = nRF2460: 2.4GHz Single Chip Wireless Audio Streamer; Manufacturer: Nordic Semiconductor; Note: nRF2460 QFN36; Artikkelnr Noca: N.A.; Part Number: nRF2460; Manufacturer Part Number: nRF2460; Datasheet: *; Footprint: QFN-36; LatestRevisionDate: 2011-03-01; Pin Count: 36; Publisher: Nordic Semiconductor; Published: 2011-03-01; Value: nRF2460; Supplier: Nordic; Supplier part number: *; 2nd source Supplier: *; 2nd source part number: *

## Sheet Nrf2460_2.SchDoc: nRF2789_Dual_Wireless_Mic_RX
size A4; DrawnBy: ANOL; Revision: 1.0
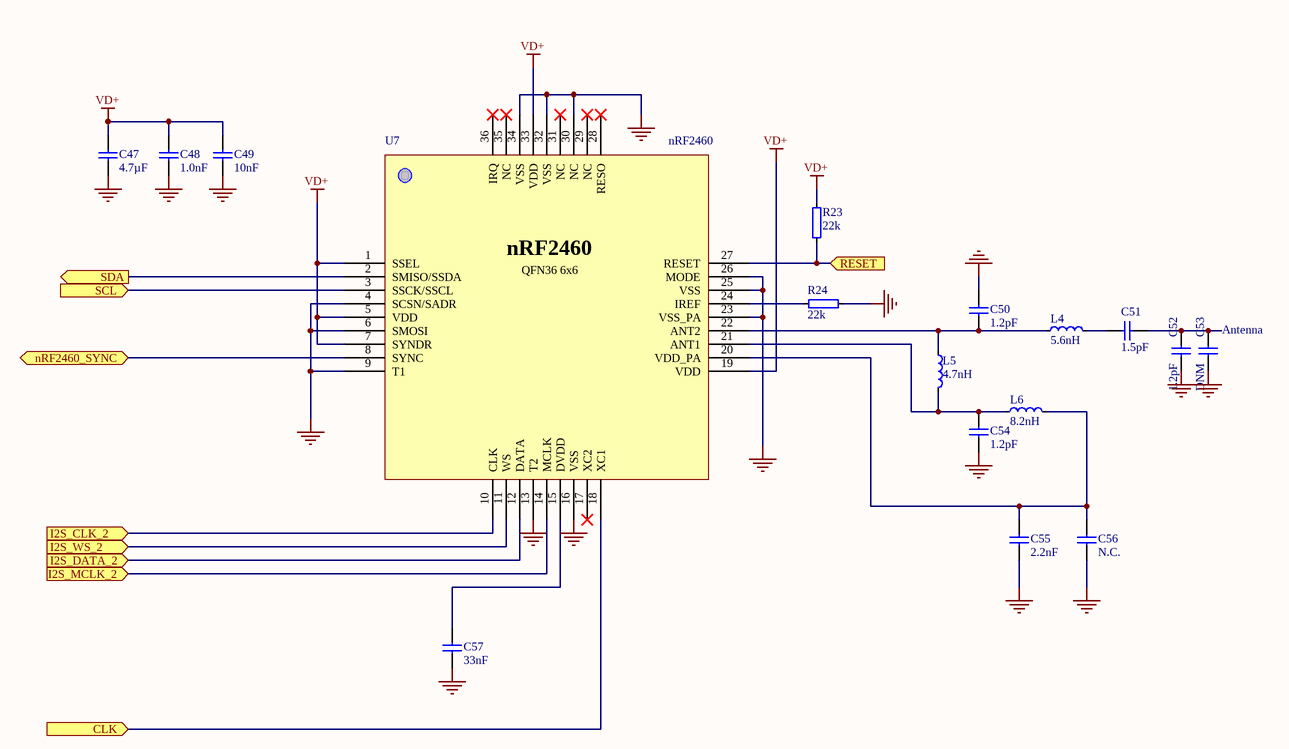
[diagram p6: Nrf2460_2.SchDoc]

### Parts
C47  4.7µF  [0805]
C48  1.0nF  [0402s]
C49  10nF  [0402s]
C50  1.2pF  [0402s]
C51  1.5pF  [0402s]
C52  1.2pF  [0402s]
C53  DNM  [0402s]
C54  1.2pF  [0402s]
C55  2.2nF  [0402s]
C56  N.C.  [0402s]  (no BOM)
C57  33nF  [0402s]
L4  5.6nH  [0402s]
L5  4.7nH  [0402s]
L6  8.2nH  [0402s]
R23  22k  [0402s]
R24  22k  [0402s]
U7  nRF2460  [Nordic_QFN36]

### Ports
CLK (in), I2S_CLK_2 (in), I2S_DATA_2 (in), I2S_MCLK_2 (in), I2S_WS_2 (in), nRF2460_SYNC (bidir), RESET (in), SCL (in), SDA (out)

### Nets
GND: C47.2 C48.2 C49.2 C50.2 C52.1 C53.1 C54.1 C55.1 C56.1 C57.1 R24.1 U7.4(SCSN/SADR) U7.6(SMOSI) U7.9(T1) U7.13(T2) U7.16(VSS) U7.23(VSS_PA) U7.25(VSS) U7.26(MODE) U7.30(NC) U7.32(VSS) U7.34(VSS)
VD+: C47.1 C48.1 C49.1 R23.2 U7.1(SSEL) U7.5(VDD) U7.7(SYNDR) U7.19(VDD) U7.33(VDD)
NetC50_1: C50.1 L4.1 L5.1 U7.22(ANT2)
NetC51_1: C51.1 C52.2 C53.2
NetC51_2: C51.2 L4.2
NetC54_2: C54.2 L5.2 L6.1 U7.21(ANT1)
NetC55_2: C55.2 C56.2 L6.2 U7.20(VDD_PA)
NetC57_2: C57.2 U7.15(DVDD)
NetR18_2: U7.3(SSCK/SSCL) ; port SCL
NetR19_2: U7.2(SMISO/SSDA) ; port SDA
NetR21_1: R23.1 U7.27(RESET) ; port RESET
NetR24_2: R24.2 U7.24(IREF)
NetU2_4: U7.14(MCLK) ; port I2S_MCLK_2
NetU2_5: U7.10(CLK) ; port I2S_CLK_2
NetU2_6: U7.12(DATA) ; port I2S_DATA_2
NetU2_7: U7.11(WS) ; port I2S_WS_2
NetU4_23: U7.18(XC1) ; port CLK
NetU6_8: U7.8(SYNC) ; port nRF2460_SYNC

Not connected (* = marked no-connect by the designer): U7 17(XC2)* 28(RESO)* 29(NC)* 31(NC)* 35(NC)* 36(IRQ)*

### Notes on the sheet
- (near C53) Antenna
- (in symbol nRF2460) QFN36 6x6

### Library data of the parts
C47 = C0805-4µ7: as C58 on sheet Power; Published: 2009-08-21; LatestRevisionDate: 2009-11-23; Publisher: Nordic Semiconductor; Value: 4.7µF; Part Number: C0805-4µ7; Manufacturer: *; Manufacturer Part Number: *; Datasheet: *; Pin Count: 2; Supplier: *; Supplier part number: *; 2nd source Supplier: *; 2nd source part number: *
C48 = C0402-1n0: as C37 on sheet Nrf2460_1; Published: 2009-05-08; LatestRevisionDate: 2009-11-23; Publisher: Nordic Semiconductor; Value: 1.0nF; Part Number: C0402-1n0; Manufacturer: *; Manufacturer Part Number: *; Datasheet: *; Pin Count: 2; Supplier: *; Supplier part number: *; 2nd source Supplier: *; 2nd source part number: *
C49 = C0402-10n: as C38 on sheet Nrf2460_1; Published: 2009-05-08; LatestRevisionDate: 2009-11-23; Publisher: Nordic Semiconductor; Value: 10nF; Part Number: C0402-10n; Manufacturer: *; Manufacturer Part Number: *; Datasheet: *; Pin Count: 2; Supplier: *; Supplier part number: *; 2nd source Supplier: *; 2nd source part number: *
C50 C52-C54 = C0402-1.2p: as C39 on sheet Nrf2460_1; Part Number: C0402-1.2p; Manufacturer: *; Manufacturer Part Number: *; Datasheet: *; LatestRevisionDate: 2009-05-08; Pin Count: 2; Publisher: Nordic Semiconductor; Published: 2009-05-08; Supplier: *; Supplier part number: *; 2nd source Supplier: *; 2nd source part number: *
  C50 C52 C54: Value: 1.2pF
  C53: Value: DNM
C51 = C0402-1.5p: as C40 on sheet Nrf2460_1; Part Number: C0402-1.5p; Manufacturer: *; Manufacturer Part Number: *; Datasheet: *; LatestRevisionDate: 2009-11-23; Pin Count: 2; Publisher: Nordic Semiconductor; Published: 2009-05-08; Value: 1.5pF; Supplier: *; Supplier part number: *; 2nd source Supplier: *; 2nd source part number: *
C55 = C0402-2n2: as C4 on sheet AK4430_1; Part Number: C0402-2n2; Manufacturer: *; Manufacturer Part Number: *; Datasheet: *; LatestRevisionDate: 2009-11-23; Pin Count: 2; Publisher: Nordic Semiconductor; Published: 2009-05-08; Value: 2.2nF; Supplier: *; Supplier part number: *; 2nd source Supplier: *; 2nd source part number: *
C56 = C0402-N.C.: Chip Cap 0402; Artikkelnr Noca: N.A.; Part Number: C0402-N.C.; Manufacturer: *; Manufacturer Part Number: *; Datasheet: *; LatestRevisionDate: 2009-05-08; Pin Count: 2; Publisher: Nordic Semiconductor; Published: 2009-05-08; Value: N.C.; Note: Chip Cap; Supplier: *; Supplier part number: *; 2nd source Supplier: *; 2nd source part number: *
C57 = C0402-33n: as C46 on sheet Nrf2460_1; Published: 2009-05-08; Publisher: Nordic Semiconductor; Value: 33nF; Part Number: C0402-33n; Manufacturer: *; Manufacturer Part Number: *; Datasheet: *; LatestRevisionDate: 2009-11-23; Pin Count: 2; Supplier: *; Supplier part number: *; 2nd source Supplier: *; 2nd source part number: *
L4 = L0402-5n6: as L1 on sheet Nrf2460_1; Part Number: L0402-5n6; Datasheet: http://search.murata.co.jp/Ceramy/image/img/PDF/ENG/L0075S0084LQP15M.pdf; Footprint: 0402; LatestRevisionDate: 2009-11-23; Pin Count: 2; Publisher: Nordic Semiconductor; Published: 2009-05-08; Value: 5.6nH; Supplier: Digi-Key; Supplier part number: 490-1133-1-ND; 2nd source Supplier: *; 2nd source part number: *
L5 = L0402-4n7: as L2 on sheet Nrf2460_1; Part Number: L0402-4n7; Datasheet: http://search.murata.co.jp/Ceramy/image/img/PDF/ENG/L0075S0084LQP15M.pdf; Footprint: 0402; LatestRevisionDate: 2009-11-23; Pin Count: 2; Publisher: Nordic Semiconductor; Published: 2009-05-08; Value: 4.7nH; Supplier: Digi-Key; Supplier part number: 490-1132-1-ND; 2nd source Supplier: *; 2nd source part number: *
L6 = L0402-8n2: as L3 on sheet Nrf2460_1; Part Number: L0402-8n2; Datasheet: http://search.murata.co.jp/Ceramy/image/img/PDF/ENG/L0075S0084LQP15M.pdf; Footprint: 0402; LatestRevisionDate: 2009-11-23; Pin Count: 2; Publisher: Nordic Semiconductor; Published: 2009-05-08; Value: 8.2nH; Supplier: Digi-Key; Supplier part number: 490-1135-1-ND; 2nd source Supplier: *; 2nd source part number: *
R23 R24 = R0402-22k: as R2 on sheet AK4430_1; Published: 2009-05-08; LatestRevisionDate: 2009-11-23; Publisher: Nordic Semiconductor; Value: 22k; Part Number: R0402-22k; Manufacturer: *; Manufacturer Part Number: *; Datasheet: *; Footprint: 0402; Pin Count: 2; Supplier: *; Supplier part number: *; 2nd source Supplier: *; 2nd source part number: *
U7 = nRF2460: as U6 on sheet Nrf2460_1; Part Number: nRF2460; Manufacturer Part Number: nRF2460; Datasheet: *; Footprint: QFN-36; LatestRevisionDate: 2011-03-01; Pin Count: 36; Publisher: Nordic Semiconductor; Published: 2011-03-01; Value: nRF2460; Supplier: Nordic; Supplier part number: *; 2nd source Supplier: *; 2nd source part number: *

## Nets that join several sheets
GND: AK4430_1 (12 pins), Micro (6 pins), Power (6 pins), AK5374 (32 pins), AK4430_2 (12 pins), Nrf2460_1 (22 pins), Nrf2460_2 (22 pins)
VA+: AK4430_1 (6 pins), Power (C59.2 U8.1), AK5374 (10 pins), AK4430_2 (6 pins)
VBUS: Micro (P6.6), Power (C58.2 C60.2 U8.2 U9.2), AK5374 (P5.1)
VD+: Micro (7 pins), Power (C61.2 U9.1), AK5374 (C17.2 U3.7 U3.8), Nrf2460_1 (9 pins), Nrf2460_2 (9 pins)
NetR2_2: AK4430_1 (R2.2 R3.2), AK5374 (R8.2)
NetR5_2: AK5374 (R7.2), AK4430_2 (R5.2 R6.2)
NetR18_2: Micro (R18.2 U5.7), Nrf2460_1 (U6.3), Nrf2460_2 (U7.3)
NetR19_2: Micro (R19.2 U5.8), Nrf2460_1 (U6.2), Nrf2460_2 (U7.2)
NetR21_1: Micro (U5.10), Nrf2460_1 (R21.1 U6.27), Nrf2460_2 (R23.1 U7.27)
NetU1_3: AK4430_1 (U1.3), Micro (U5.5)
NetU1_4: AK4430_1 (U1.4), Nrf2460_1 (U6.14)
NetU1_5: AK4430_1 (U1.5), Nrf2460_1 (U6.10)
NetU1_6: AK4430_1 (U1.6), Nrf2460_1 (U6.12)
NetU1_7: AK4430_1 (U1.7), Nrf2460_1 (U6.11)
NetU2_3: Micro (U5.6), AK4430_2 (U2.3)
NetU2_4: AK4430_2 (U2.4), Nrf2460_2 (U7.14)
NetU2_5: AK4430_2 (U2.5), Nrf2460_2 (U7.10)
NetU2_6: AK4430_2 (U2.6), Nrf2460_2 (U7.12)
NetU2_7: AK4430_2 (U2.7), Nrf2460_2 (U7.11)
NetU4_7: Micro (U5.9), AK5374 (U4.7)
NetU4_23: AK5374 (U4.23), Nrf2460_1 (U6.18), Nrf2460_2 (U7.18)
NetU6_8: Nrf2460_1 (U6.8), Nrf2460_2 (U7.8)